# EasyEDA schematic SCH_Piano 12 keys_2022-07-06.json
TITLE: Sheet_1; REV: 1.0; Date: 2022-06-29; Sheet: 1/1; Drawn By: limchengwei; Company: Your Company
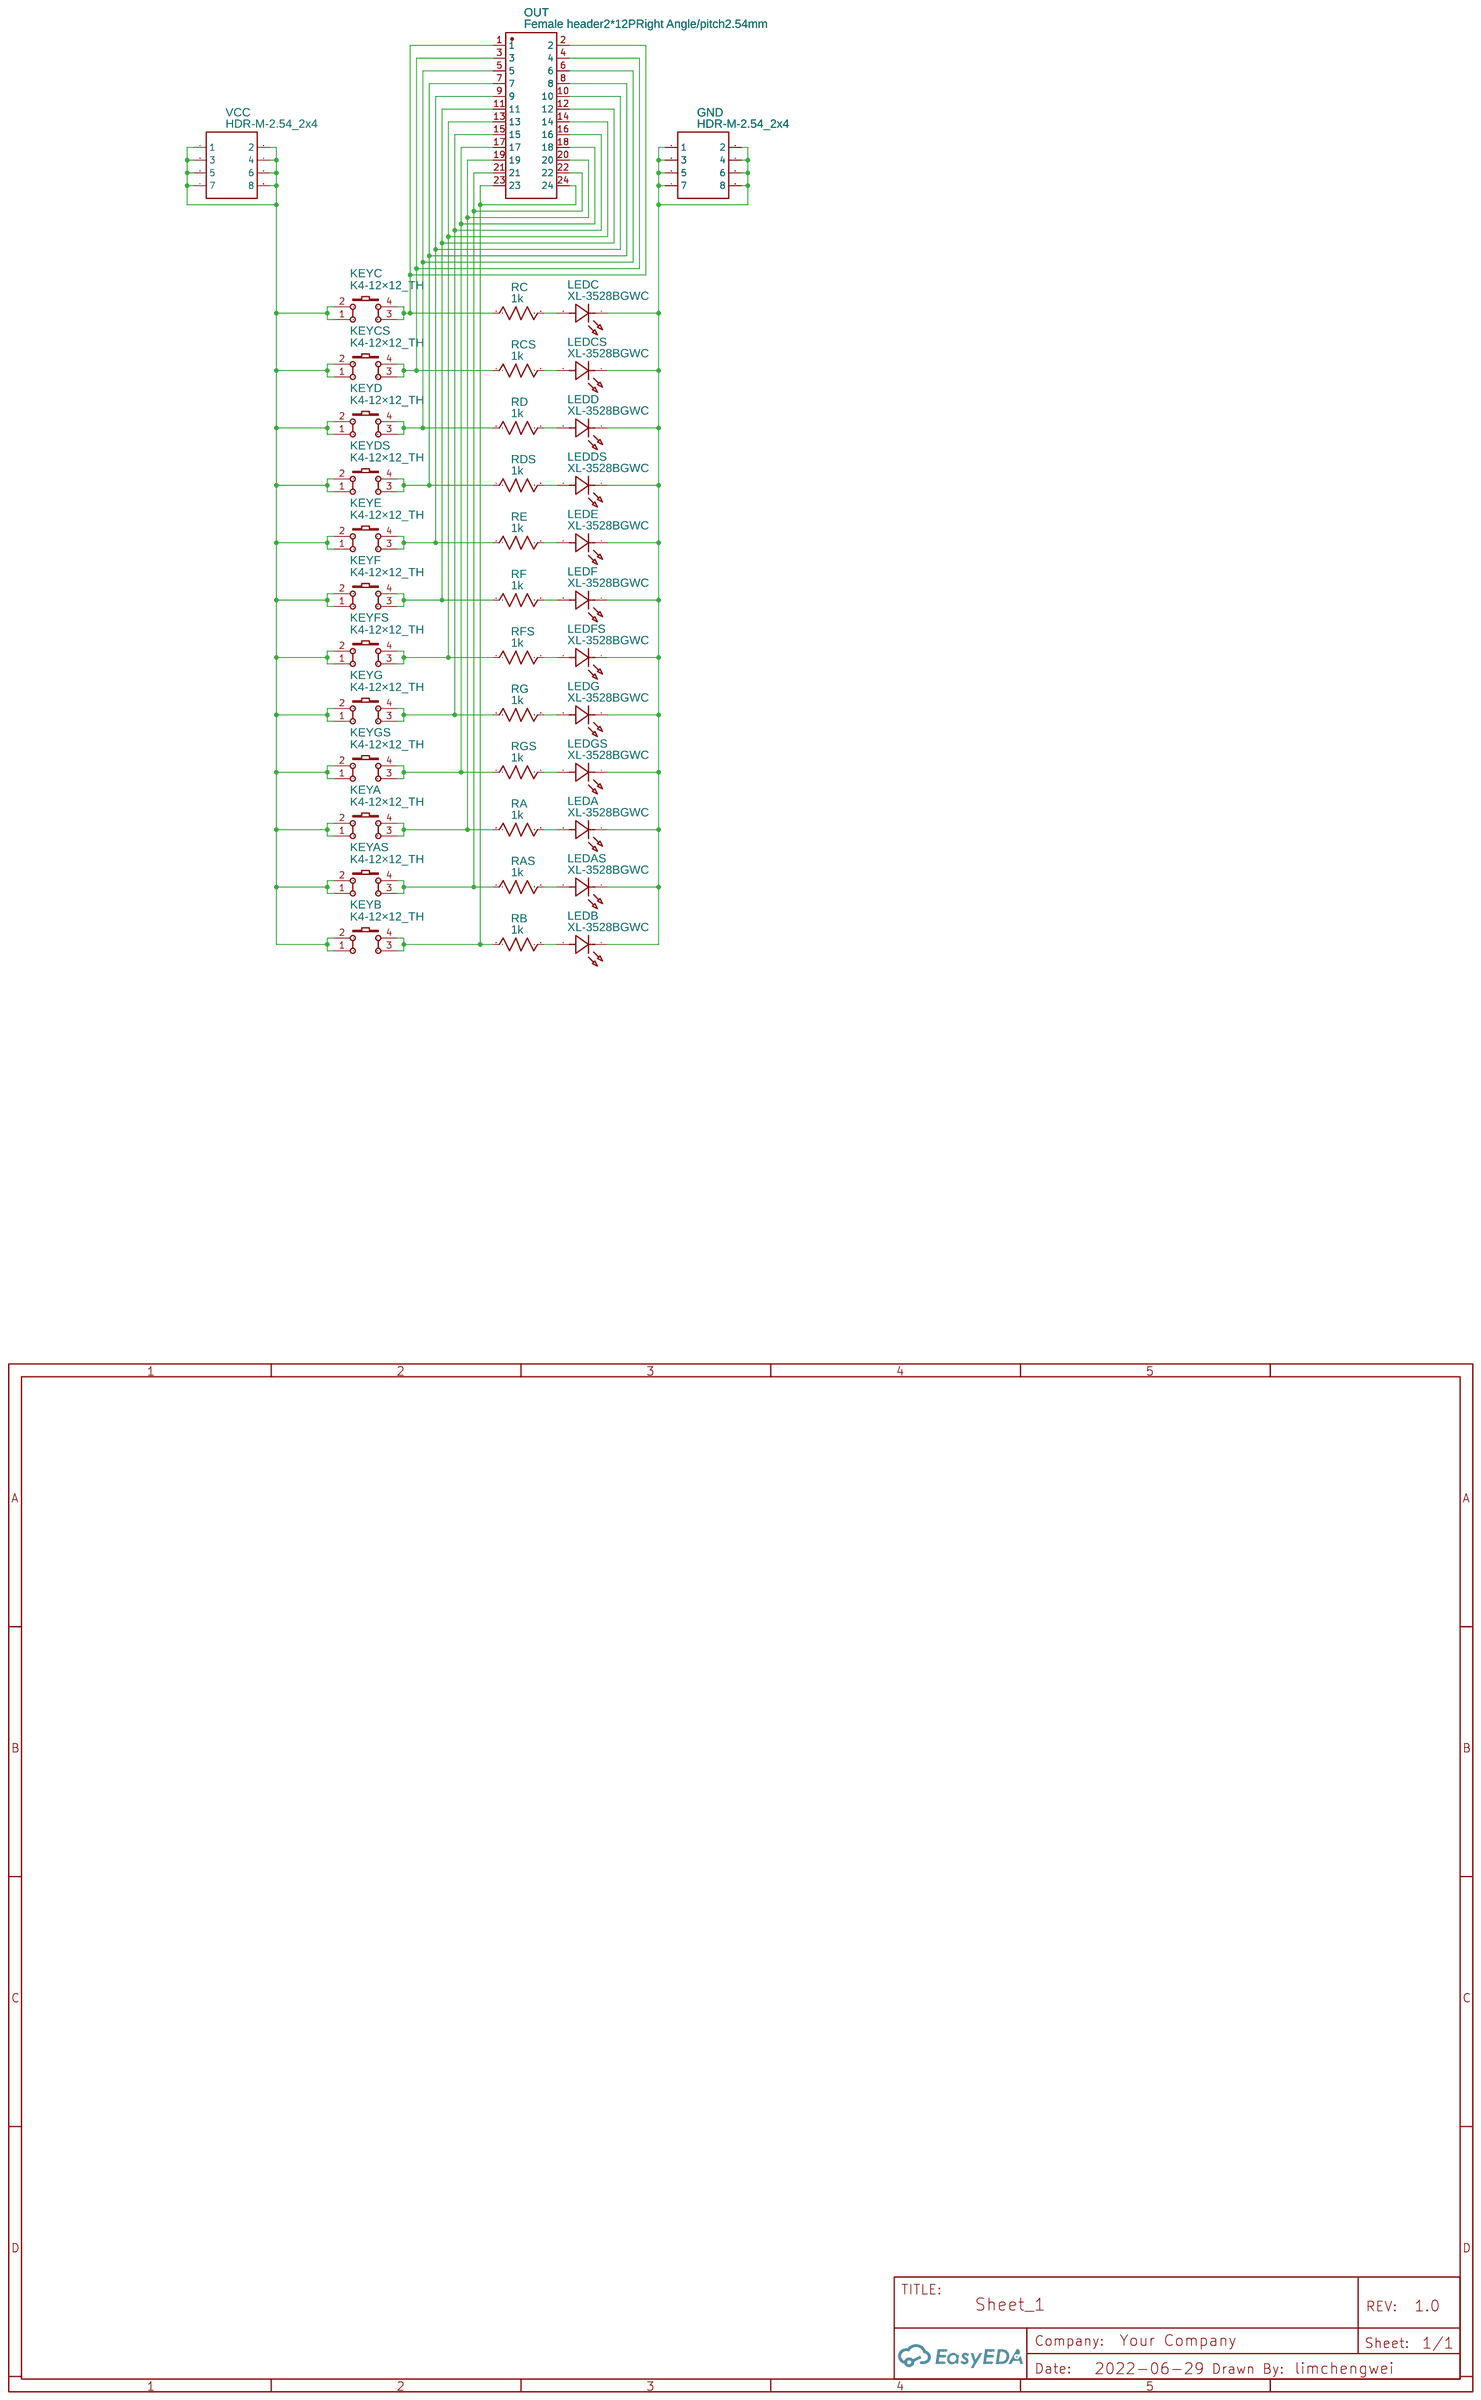
[diagram p0: schematic sheet]

## Parts
GND  HDR-M-2.54_2x4  [HDR-M-2.54_2X4]
KEYA  K4-12×12_TH  [KEY-TH_4P-L12.0-W12.0-P5.00-LS12.5]
KEYAS  K4-12×12_TH  [KEY-TH_4P-L12.0-W12.0-P5.00-LS12.5]
KEYB  K4-12×12_TH  [KEY-TH_4P-L12.0-W12.0-P5.00-LS12.5]
KEYC  K4-12×12_TH  [KEY-TH_4P-L12.0-W12.0-P5.00-LS12.5]
KEYCS  K4-12×12_TH  [KEY-TH_4P-L12.0-W12.0-P5.00-LS12.5]
KEYD  K4-12×12_TH  [KEY-TH_4P-L12.0-W12.0-P5.00-LS12.5]
KEYDS  K4-12×12_TH  [KEY-TH_4P-L12.0-W12.0-P5.00-LS12.5]
KEYE  K4-12×12_TH  [KEY-TH_4P-L12.0-W12.0-P5.00-LS12.5]
KEYF  K4-12×12_TH  [KEY-TH_4P-L12.0-W12.0-P5.00-LS12.5]
KEYFS  K4-12×12_TH  [KEY-TH_4P-L12.0-W12.0-P5.00-LS12.5]
KEYG  K4-12×12_TH  [KEY-TH_4P-L12.0-W12.0-P5.00-LS12.5]
KEYGS  K4-12×12_TH  [KEY-TH_4P-L12.0-W12.0-P5.00-LS12.5]
LEDA  XL-3528BGWC  [LED-SMD_L3.5-W2.8-RD_BLUE]
LEDAS  XL-3528BGWC  [LED-SMD_L3.5-W2.8-RD_BLUE]
LEDB  XL-3528BGWC  [LED-SMD_L3.5-W2.8-RD_BLUE]
LEDC  XL-3528BGWC  [LED-SMD_L3.5-W2.8-RD_BLUE]
LEDCS  XL-3528BGWC  [LED-SMD_L3.5-W2.8-RD_BLUE]
LEDD  XL-3528BGWC  [LED-SMD_L3.5-W2.8-RD_BLUE]
LEDDS  XL-3528BGWC  [LED-SMD_L3.5-W2.8-RD_BLUE]
LEDE  XL-3528BGWC  [LED-SMD_L3.5-W2.8-RD_BLUE]
LEDF  XL-3528BGWC  [LED-SMD_L3.5-W2.8-RD_BLUE]
LEDFS  XL-3528BGWC  [LED-SMD_L3.5-W2.8-RD_BLUE]
LEDG  XL-3528BGWC  [LED-SMD_L3.5-W2.8-RD_BLUE]
LEDGS  XL-3528BGWC  [LED-SMD_L3.5-W2.8-RD_BLUE]
OUT  Female header2*12PRight Angle/pitch2.54mm  [HDR-TH_24P-P2.54-V-F-R2-C12-S2.54]
RA  1k  [R1206]
RAS  1k  [R1206]
RB  1k  [R1206]
RC  1k  [R1206]
RCS  1k  [R1206]
RD  1k  [R1206]
RDS  1k  [R1206]
RE  1k  [R1206]
RF  1k  [R1206]
RFS  1k  [R1206]
RG  1k  [R1206]
RGS  1k  [R1206]
VCC  HDR-M-2.54_2x4  [HDR-M-2.54_2X4]

## Library data of the parts
GND VCC = HDR-M-2.54_2x4: Supplier Part: C58363; Supplier: LCSC; Contributor: LCEDA_Lib
KEYA KEYAS KEYB KEYC KEYCS KEYD KEYDS KEYE KEYF KEYFS KEYG KEYGS = K4-12×12_TH: Supplier Part: C128053; Supplier: LCSC; Manufacturer: 韩国韩荣; Manufacturer Part: K2-1103DP-M4SW-04; Contributor: LCEDA_Lib
LEDA LEDAS LEDB LEDC LEDCS LEDD LEDDS LEDE LEDF LEDFS LEDG LEDGS = XL-3528BGWC: Supplier: LCSC; Supplier Part: C2843807; Manufacturer: XINGLIGHT(成兴光); JLCPCB Part Class: Extended Part; Contributor: LCSC
OUT = Female header2*12PRight Angle/pitch2.54mm: Supplier: LCSC; Manufacturer: BOOMELE; Supplier Part: C62744; JLCPCB Part Class: Extended Part
RA RAS RB RC RCS RD RDS RE RF RFS RG RGS = R_1206_US: Contributor: LCEDA_Lib

## Nets
Net-(GND-1): GND.1 GND.2 GND.3 GND.4 GND.5 GND.6 GND.7 GND.8 LEDA.1(K) LEDAS.1(K) LEDB.1(K) LEDC.1(K) LEDCS.1(K) LEDD.1(K) LEDDS.1(K) LEDE.1(K) LEDF.1(K) LEDFS.1(K) LEDG.1(K) LEDGS.1(K)
Net-(KEYA-1): KEYA.1 KEYA.2 KEYAS.1 KEYAS.2 KEYB.1 KEYB.2 KEYC.1 KEYC.2 KEYCS.1 KEYCS.2 KEYD.1 KEYD.2 KEYDS.1 KEYDS.2 KEYE.1 KEYE.2 KEYF.1 KEYF.2 KEYFS.1 KEYFS.2 KEYG.1 KEYG.2 KEYGS.1 KEYGS.2 VCC.1 VCC.2 VCC.3 VCC.4 VCC.5 VCC.6 VCC.7 VCC.8
Net-(KEYA-3): KEYA.3 KEYA.4 OUT.19 OUT.20 RA.1
Net-(KEYAS-3): KEYAS.3 KEYAS.4 OUT.21 OUT.22 RAS.1
Net-(KEYB-3): KEYB.3 KEYB.4 OUT.23 OUT.24 RB.1
Net-(KEYC-3): KEYC.3 KEYC.4 OUT.1 OUT.2 RC.1
Net-(KEYCS-3): KEYCS.3 KEYCS.4 OUT.3 OUT.4 RCS.1
Net-(KEYD-3): KEYD.3 KEYD.4 OUT.5 OUT.6 RD.1
Net-(KEYDS-3): KEYDS.3 KEYDS.4 OUT.7 OUT.8 RDS.1
Net-(KEYE-3): KEYE.3 KEYE.4 OUT.9 OUT.10 RE.1
Net-(KEYF-3): KEYF.3 KEYF.4 OUT.11 OUT.12 RF.1
Net-(KEYFS-3): KEYFS.3 KEYFS.4 OUT.13 OUT.14 RFS.1
Net-(KEYG-3): KEYG.3 KEYG.4 OUT.15 OUT.16 RG.1
Net-(KEYGS-3): KEYGS.3 KEYGS.4 OUT.17 OUT.18 RGS.1
Net-(LEDA-2): LEDA.2(A) RA.2
Net-(LEDAS-2): LEDAS.2(A) RAS.2
Net-(LEDB-2): LEDB.2(A) RB.2
Net-(LEDC-2): LEDC.2(A) RC.2
Net-(LEDCS-2): LEDCS.2(A) RCS.2
Net-(LEDD-2): LEDD.2(A) RD.2
Net-(LEDDS-2): LEDDS.2(A) RDS.2
Net-(LEDE-2): LEDE.2(A) RE.2
Net-(LEDF-2): LEDF.2(A) RF.2
Net-(LEDFS-2): LEDFS.2(A) RFS.2
Net-(LEDG-2): LEDG.2(A) RG.2
Net-(LEDGS-2): LEDGS.2(A) RGS.2
